# EAGLE design esp8266_esp12_header (EAGLE 7.4.0)
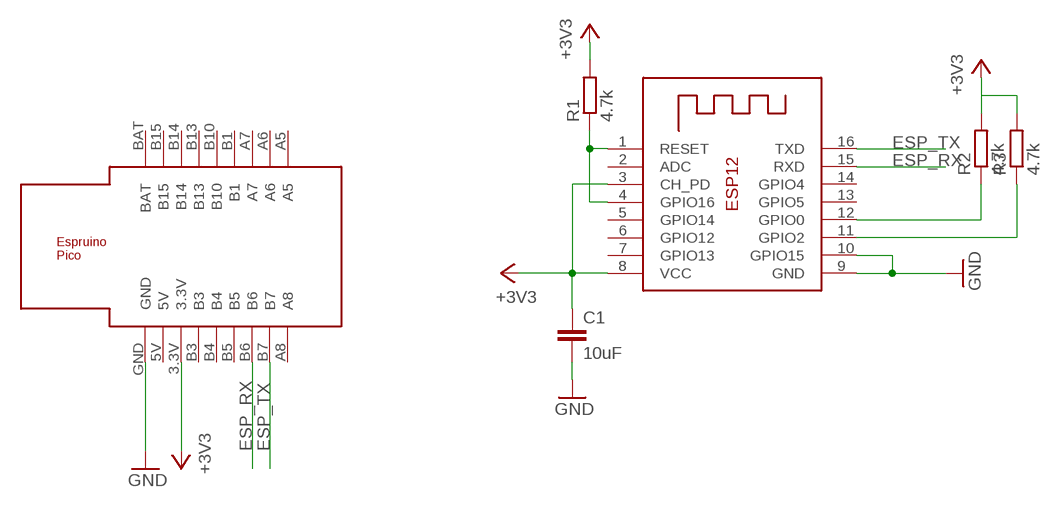
[diagram p0: schematic, sheet 1]

## Parts
C1  10uF  C-EUC1210  [C1210]
R1  4.7k  R-EU_R1206  [R1206]
R2  4.7k  R-EU_R1206  [R1206]
R3  4.7k  R-EU_R1206  [R1206]
U$1  ESPRUINO_PICO_0.1  [ESPRUINO_PICO_0.1]
X1  ESP-12  [ESP-12]

## Nets
+3V3: C1.1 R1.2 R2.2 R3.2 U$1.3.3V X1.3(CH_PD) X1.8(VCC)
ESP_RX: U$1.B6 X1.15(RXD)
ESP_TX: U$1.B7 X1.16(TXD)
GND: C1.2 U$1.GND X1.9(GND) X1.10(GPIO15)
N$1: R3.1 X1.11(GPIO2)
N$2: R2.1 X1.12(GPIO0)
N$9: R1.1 X1.1(RESET) X1.4(GPIO16)
Unconnected: U$1.5V U$1.A5 U$1.A6 U$1.A7 U$1.A8 U$1.B1 U$1.B3 U$1.B4 U$1.B5 U$1.B10 U$1.B13 U$1.B14 U$1.B15 U$1.BAT X1.2(ADC) X1.5(GPIO14) X1.6(GPIO12) X1.7(GPIO13) X1.13(GPIO5) X1.14(GPIO4)

## Library data of the parts
C1 = rcl:C-EU: CAPACITOR, European symbol
R1-R3 = rcl:R-EU_: RESISTOR, European symbol
U$1 = espruino_pico:ESPRUINO_PICO_0.1
X1 = adafruit:ESP-12

## Net classes
0 default: width 0.305 mm

## Board
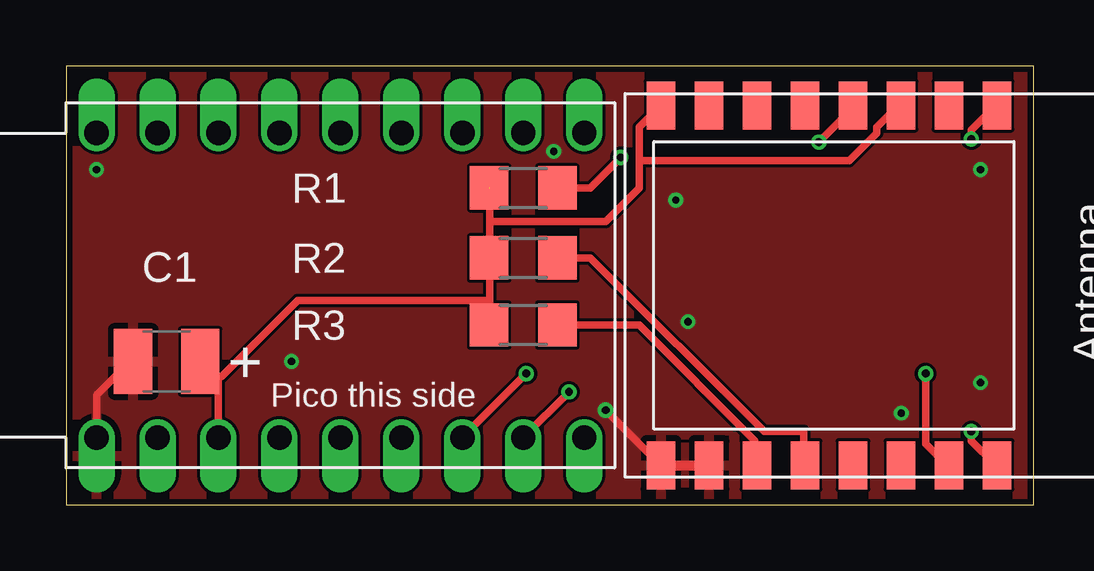
[diagram p1: board, top side]
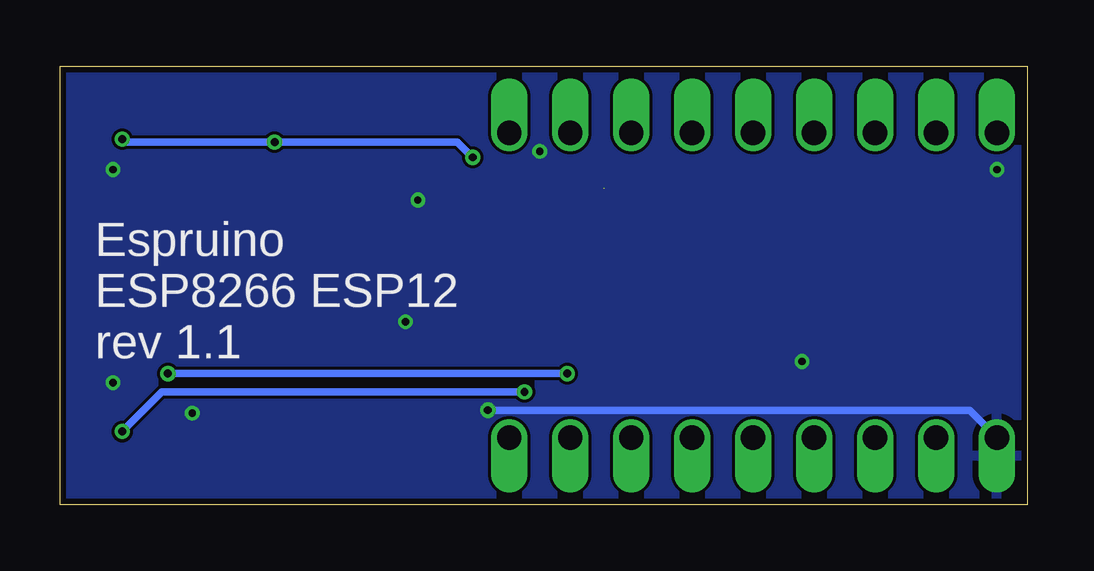
[diagram p2: board, bottom side, seen from below]

Size 40.31 x 18.28 mm. Coordinates in mm from the lower left corner, seen from the top.
Outline: 0,0 40.31,0 40.31,18.28 0,18.28 0,0
Copper layers (1*16): Top 0.035mm / dielectric 1.5mm / Bottom 0.035mm
Design rules "dirt_cheap_dirty_boards.v1": minimum track width 5mil, minimum drill 12mil, track to track 5mil, track to pad 5mil, pad to pad 5mil, via to via 5mil, smd to smd 0mil, copper to edge 10mil, drill to drill 10mil, minimum pad ring 10mil, minimum via ring 6mil, stop-mask expansion 2mil, vias tented up to drill 25mil, thermal gap 10mil

### Footprints (pad centres in the part's own frame; a part is rotated, then mirrored left to right if it is on the bottom)
C1210 = smd 1.6 x 2.7: 1 -1.4,0; 2 1.4,0
R1206 = smd 1.6 x 1.803: 1 -1.422,0; 2 1.422,0
ESPRUINO_PICO_0.1 = drill 1.016 offset: 3.3V -7.62,-6.35; 5V -10.16,-6.35; A5 7.62,6.35; A6 5.08,6.35; A7 2.54,6.35; A8 7.62,-6.35; B1 0,6.35; B3 -5.08,-6.35; B4 -2.54,-6.35; B5 0,-6.35; B6 2.54,-6.35; B7 5.08,-6.35; B10 -2.54,6.35; B13 -5.08,6.35; B14 -7.62,6.35; B15 -10.16,6.35; BAT -12.7,6.35; GND -12.7,-6.35
ESP-12 = smd 2 x 1.2: 1 -7.5,4.5; 2 -7.5,2.5; 3 -7.5,0.5; 4 -7.5,-1.5; 5 -7.5,-3.5; 6 -7.5,-5.5; 7 -7.5,-7.5; 8 -7.5,-9.5; 9 7.5,-9.5; 10 7.5,-7.5; 11 7.5,-5.5; 12 7.5,-3.5; 13 7.5,-1.5; 14 7.5,0.5; 15 7.5,2.5; 16 7.5,4.5

### Placement (x,y rotation side)
C1  4.19,5.97 180 top
R1  19.05,13.21 180 top
R2  19.05,10.29 180 top
R3  19.05,7.49 180 top
U$1  13.97,9.14 0 top
X1  34.29,9.14 270 top

### Tracks (layer width: path | path; a pad name or v marks a point on that pad's centre or on a via)
+3V3  (1 unrouted)
  Top 0.305: 6.35,5.33 5.71,5.97 C1.1 | U$1.3.3V 6.35,5.33 | 17.65,8.51 17.65,10.29 R2.2 17.65,10.41 17.65,11.81 | 17.65,8.51 17.65,7.49 R3.2 | 17.65,11.81 17.65,13.21 | 23.88,14.35 23.88,13.21 22.48,11.81 17.65,11.81 | 23.88,14.35 23.88,15.75 24.77,16.64 X1.8 | 23.88,14.35 32.64,14.35 33.78,15.49 33.78,15.75 34.67,16.64 X1.3 | 17.65,8.51 9.65,8.51 6.48,5.33 6.35,5.33
ESP_RX  (via drill 0.33)
  Top 0.305: v35.81,5.46 35.81,2.54 36.7,1.65 X1.15 | U$1.B6 v19.18,5.46
  Bottom 0.305: v19.18,5.46 v35.81,5.46
ESP_TX  (via drill 0.33)
  Top 0.305: v37.72,3.05 37.72,2.67 38.73,1.65 X1.16 | U$1.B7 v20.95,4.7
  Bottom 0.305: v37.72,3.05 36.07,4.7 v20.95,4.7
GND  (via drill 0.3, 0.33)
  Top 0.305: v22.48,3.94 24.77,1.65 X1.9 | U$1.GND 1.27,4.57 2.67,5.97 C1.2
  Top 0.406: X1.9 X1.10
  Bottom 0.305: v22.48,3.94 2.41,3.94 U$1.GND
  other vias: 1.27,13.97 9.4,5.97 25.4,12.7 38.1,13.97 38.1,5.08 34.8,3.81 25.91,7.62 20.32,14.73
  pour Bottom: -1.27,19.05 41.91,19.05 41.91,-1.27 -1.27,-1.27
  pour Top: -1.27,19.05 41.91,19.05 41.91,-1.27 -1.27,-1.27
N$1
  Top 0.305: R3.1 23.88,7.49 28.7,2.67 28.7,1.65 X1.11
N$2
  Top 0.305: R2.1 21.84,10.29 29.08,3.05 30.73,3.05 30.73,1.65 X1.12
N$9  (via drill 0.33)
  Top 0.305: v23.11,14.48 21.84,13.21 R1.1 | v31.37,15.11 32.77,16.51 32.77,16.64 X1.4 | v37.72,15.24 37.72,15.62 38.73,16.64 X1.1
  Bottom 0.305: v23.11,14.48 23.75,15.11 v31.37,15.11 37.59,15.11 v37.72,15.24

### Text on the board
tNames: + | Pico this side
bNames: Espruino / ESP8266 ESP12 / rev 1.1